# EAGLE design hottub (EAGLE 9.6.2)
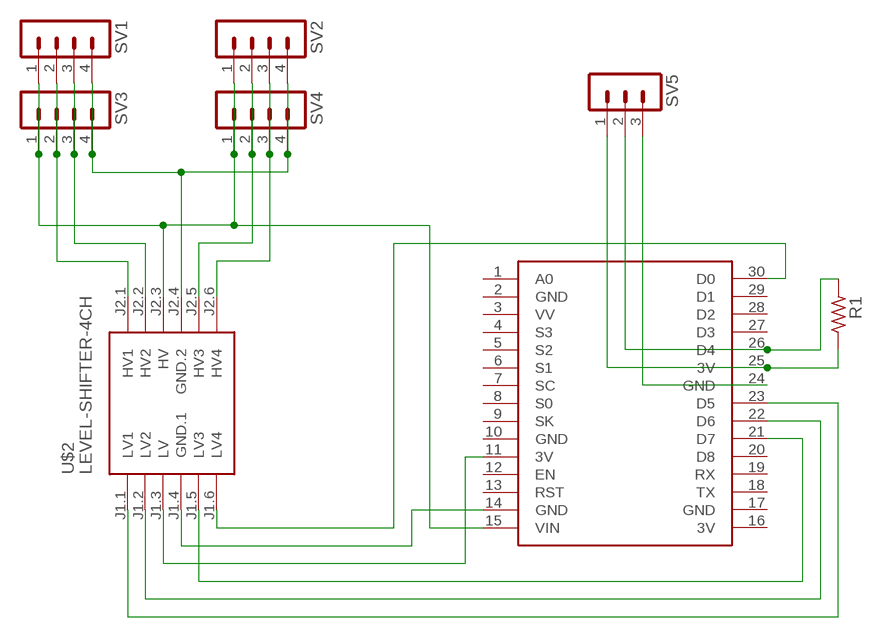
[diagram p0: schematic, sheet 1]

## Parts
R1  R_1206  [R1206]
SV1  MA04-1  [MA04-1]
SV2  MA04-1  [MA04-1]
SV3  MA04-1  [MA04-1]
SV4  MA04-1  [MA04-1]
SV5  MA03-1  [MA03-1]
U$1  NODEMCU  [NODEMCU]
U$2  LEVEL-SHIFTER-4CH  [LEVEL-SHIFTER-4CH]

## Nets
N$1: R1.2 SV5.1 U$1.25(3V)
N$2: SV1.2 SV3.2 U$2.J2.1(HV1)
N$3: SV1.3 SV3.3 U$2.J2.2(HV2)
N$4: SV5.3 U$1.24(GND)
N$5: U$1.14(GND) U$2.J1.4(GND.1)
N$6: SV1.1 SV2.1 SV3.1 SV4.1 U$1.15(VIN) U$2.J2.3(HV)
N$7: SV2.2 SV4.2 U$2.J2.5(HV3)
N$8: U$1.30(D0) U$2.J1.6(LV4)
N$9: U$1.21(D7) U$2.J1.5(LV3)
N$10: U$1.22(D6) U$2.J1.2(LV2)
N$11: U$1.23(D5) U$2.J1.1(LV1)
N$12: SV2.3 SV4.3 U$2.J2.6(HV4)
N$13: SV1.4 SV2.4 SV3.4 SV4.4 U$2.J2.4(GND.2)
N$14: R1.1 SV5.2 U$1.26(D4)
N$15: U$1.11(3V) U$2.J1.3(LV)
Unconnected: U$1.1(A0) U$1.3(VV) U$1.4(S3) U$1.5(S2) U$1.6(S1) U$1.7(SC) U$1.8(S0) U$1.9(SK) U$1.12(EN) U$1.13(RST) U$1.18(TX) U$1.19(RX) U$1.20(D8) U$1.27(D3) U$1.28(D2) U$1.29(D1)

## Power pins joined to a net without a drawn wire
3V: U$1.16(3V)
GND: U$1.2(GND) U$1.10(GND) U$1.17(GND)

## Library data of the parts
R1 = rc-master-smd:R_: RESISTOR
SV1-SV4 = con-lstb:MA04-1: PIN HEADER; OC_FARNELL: unknown; OC_NEWARK: unknown
SV5 = con-lstb:MA03-1: PIN HEADER; OC_FARNELL: unknown; OC_NEWARK: unknown
U$1 = nodemcu:NODEMCU
U$2 = diy-modules:LEVEL-SHIFTER-4CH: 4-Channel Bi-Directional Logic Level Converter based on BSS128 transistors Click here to find device on ebay.com <http://www.ebay.com/sch/i2c+logic+converter+module>

## Board
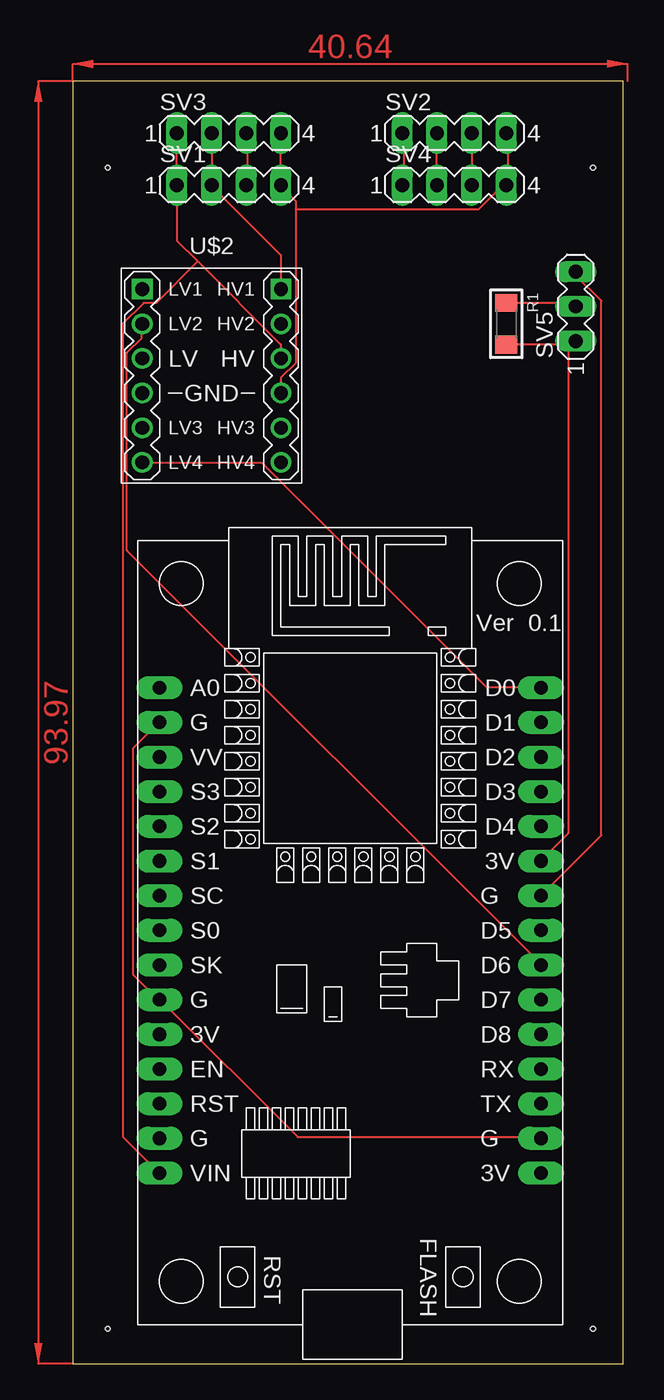
[diagram p1: board, top side]
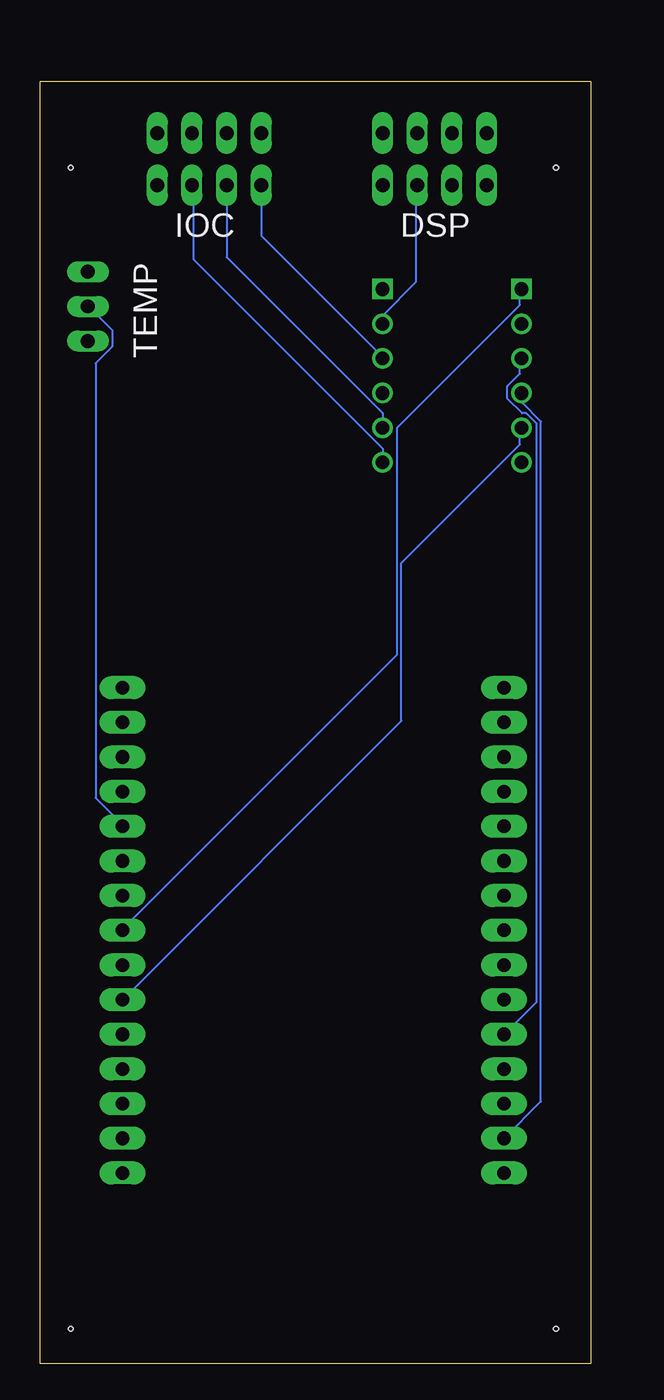
[diagram p2: board, bottom side, seen from below]

Size 40.31 x 93.97 mm. Coordinates in mm from the lower left corner, seen from the top.
Outline: 0,0 40.31,0 40.31,93.97 0,93.97 0,0
Copper layers (1*16): Top 0.035mm / dielectric 1.5mm / Bottom 0.035mm
Design rules "default": minimum track width 6mil, minimum drill 0.35mm, track to track 6mil, track to pad 6mil, pad to pad 6mil, via to via 6mil, smd to smd 6mil, copper to edge 40mil, drill to drill 6mil, minimum pad ring 10mil, minimum via ring 8mil, stop-mask expansion 4mil, vias tented up to drill 0mil, thermal gap 10mil
Holes 0.35 mm at 2.54,87.63 38.1,87.63 2.54,2.54 38.1,2.54

### Footprints (pad centres in the part's own frame; a part is rotated, then mirrored left to right if it is on the bottom)
R1206 = smd 1.3 x 1.6: 1 -1.524,0; 2 1.524,0
MA04-1 = drill 1.016 long: 1 -3.81,0; 2 -1.27,0; 3 1.27,0; 4 3.81,0
MA03-1 = drill 1.016 long: 1 -2.54,0; 2 0,0; 3 2.54,0
NODEMCU = drill 1 pad 1.676 long: 1 -13.97,17.78; 2 -13.97,15.24; 3 -13.97,12.7; 4 -13.97,10.16; 5 -13.97,7.62; 6 -13.97,5.08; 7 -13.97,2.54; 8 -13.97,0; 9 -13.97,-2.54; 10 -13.97,-5.08; 11 -13.97,-7.62; 12 -13.97,-10.16; 13 -13.97,-12.7; 14 -13.97,-15.24; 15 -13.97,-17.78; 16 13.97,-17.78; 17 13.97,-15.24; 18 13.97,-12.7; 19 13.97,-10.16; 20 13.97,-7.62; 21 13.97,-5.08; 22 13.97,-2.54; 23 13.97,0; 24 13.97,2.54; 25 13.97,5.08; 26 13.97,7.62; 27 13.97,10.16; 28 13.97,12.7; 29 13.97,15.24; 30 13.97,17.78
LEVEL-SHIFTER-4CH = drill 1 square: J1.1 -5.08,6.35; J2.1 5.08,6.35 | drill 1: J1.2 -5.08,3.81; J1.3 -5.08,1.27; J1.4 -5.08,-1.27; J1.5 -5.08,-3.81; J1.6 -5.08,-6.35; J2.2 5.08,3.81; J2.3 5.08,1.27; J2.4 5.08,-1.27; J2.5 5.08,-3.81; J2.6 5.08,-6.35

### Placement (x,y rotation side)
R1  31.75,76.2 270 top
SV1  11.43,86.36 0 top
SV2  27.94,90.17 0 top
SV3  11.43,90.17 0 top
SV4  27.94,86.36 0 top
SV5  36.83,77.47 90 top
U$1  20.32,31.75 0 top
U$2  10.16,72.39 0 top

### Tracks (layer width: path | path; a pad name or v marks a point on that pad's centre or on a via)
GND
  Top 0.152: U$1.17 34.29,16.61 16.46,16.61 6.4,26.67 U$1.10 6.25,26.67 4.42,28.5 4.42,45.11 6.25,46.94 U$1.2
N$1
  Top 0.152: 36.27,74.68 36.58,74.68 SV5.1 36.27,74.68 | 36.27,74.68 R1.2 | 36.27,74.68 36.27,38.86 34.29,36.88 U$1.25
N$2
  Top 0.152: U$2.J2.1 15.24,81.23 10.21,86.26 SV1.2 10.21,86.41 10.21,90.07 SV3.2
N$3
  Top 0.152: SV3.3 12.8,90.07 12.8,86.41 SV1.3
  Bottom 0.152: U$2.J2.2 15.24,76.81 12.8,79.25 12.8,86.26 SV1.3
N$4
  Top 0.152: U$1.24 38.71,38.71 38.71,77.88 36.88,79.7 36.88,80.01 SV5.3
N$5
  Bottom 0.152: U$1.14 3.66,19.2 3.66,69.04 5.03,70.41 5.03,71.02 U$2.J1.4
N$6
  Top 0.152: SV4.1 24.23,86.41 24.23,90.07 SV2.1 | U$2.J2.3 15.24,74.68 9.14,80.77 | 9.14,80.77 7.62,82.3 SV1.1 SV3.1 | 9.14,80.77 6.1,77.72 5.18,77.72 3.66,76.2 3.66,16.61 6.25,14.02 U$1.15
  Bottom 0.152: SV4.1 24.08,86.26 24.08,82.6 15.24,73.76 U$2.J2.3
N$7
  Top 0.152: SV4.2 SV2.2
  Bottom 0.152: U$2.J2.5 15.24,69.65 26.67,81.08 SV4.2
N$8
  Top 0.152: U$1.30 30.33,49.53 13.87,65.99 5.18,65.99 U$2.J1.6
N$9
  Bottom 0.152: U$1.21 13.87,47.09 13.87,58.67 5.18,67.36 5.18,68.58 U$2.J1.5
N$10
  Top 0.152: U$2.J1.2 5.03,76.2 5.03,75.13 3.96,74.07 3.96,59.59 34.29,29.26 U$1.22
N$11
  Bottom 0.152: U$2.J1.1 5.18,78.64 5.18,77.57 14.17,68.58 14.17,51.97 34.29,31.85 U$1.23
N$12
  Top 0.152: SV2.3 29.26,90.07 29.26,86.41 SV4.3
  Bottom 0.152: U$2.J2.6 15.24,67.06 29.11,80.92 29.11,86.26 SV4.3
N$13
  Top 0.152: SV2.4 31.85,90.07 31.85,86.41 SV4.4 31.7,86.26 31.39,86.26 29.72,84.58 16.31,84.58 | U$2.J2.4 15.24,72.24 16.31,73.3 16.31,84.58 | 16.31,84.58 16.31,85.19 15.24,86.26 SV1.4 SV3.4
N$14
  Top 0.152: R1.1 36.58,77.72 SV5.2
  Bottom 0.152: U$1.26 34.29,39.47 36.27,41.45 36.27,73.3 35.05,74.52 35.05,75.74 36.73,77.42 SV5.2
N$15
  Bottom 0.152: U$1.11 3.96,26.52 3.96,68.89 4.72,69.65 5.03,69.65 6.1,70.71 6.1,71.63 5.18,72.54 5.18,73.61 U$2.J1.3
(copper drawn outside any net)
  shapes: Top area x2

### Text on the board
bNames: DSP | IOC | TEMP